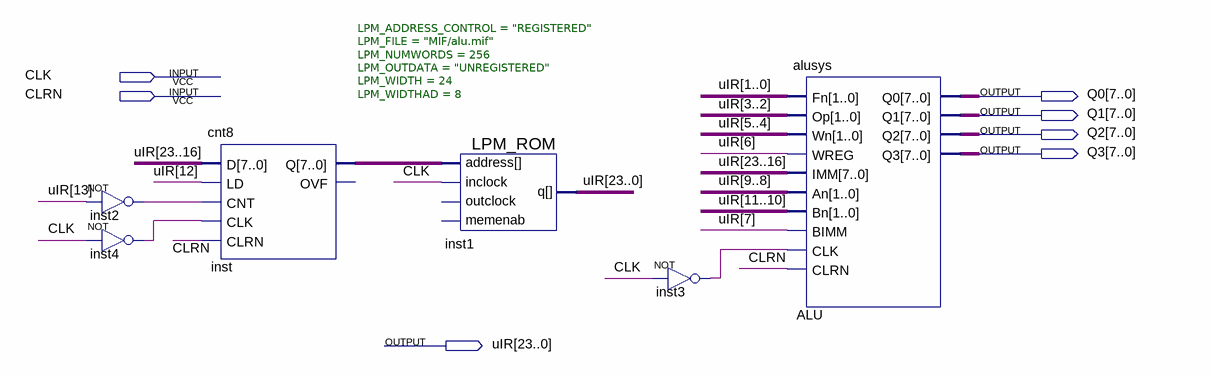
[diagram p0: schematic sheet]
// Quartus schematic alu_ROM.bdf as structural Verilog: 6 symbols, 7 pins
module alu_ROM (
  input  CLK,
  input  CLRN,
  output [7:0] Q0,
  output [7:0] Q1,
  output [7:0] Q2,
  output [7:0] Q3,
  output [23:0] uIR
);

  wire inst2_out, inst3_out, inst4_out;
  wire [7:0] inst_q;

  not inst2 (inst2_out, uIR[13]);
  not inst4 (inst4_out, CLK);
  cnt8 inst (.D(uIR[23:16]), .LD(uIR[12]), .CNT(inst2_out), .CLK(inst4_out), .CLRN(CLRN), .Q(inst_q));  // open: OVF
  LPM_ROM #(.LPM_ADDRESS_CONTROL("REGISTERED"), .LPM_FILE("MIF/alu.mif"), .LPM_NUMWORDS(256), .LPM_OUTDATA("UNREGISTERED"), .LPM_WIDTH(24), .LPM_WIDTHAD(8)) inst1 (
    .address(inst_q), .inclock(CLK), .q(uIR));  // open: outclock, memenab
  not inst3 (inst3_out, CLK);
  alusys ALU (
    .Fn(uIR[1:0]), .Op(uIR[3:2]), .Wn(uIR[5:4]), .WREG(uIR[6]), .IMM(uIR[23:16]), .An(uIR[9:8]),
    .Bn(uIR[11:10]), .BIMM(uIR[7]), .CLK(inst3_out), .CLRN(CLRN), .Q0(Q0), .Q1(Q1), .Q2(Q2), .Q3(Q3));
endmodule
